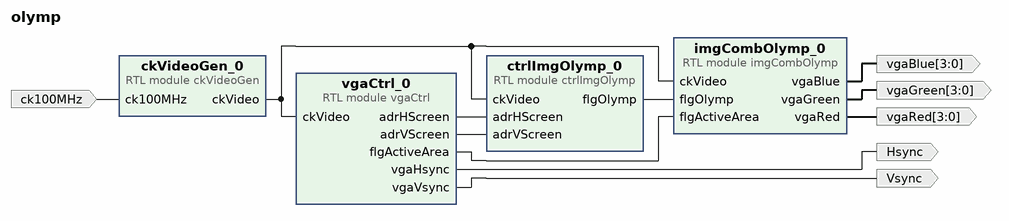
[diagram p0: block diagram of the top level]
# Vivado block design olymp, xc7a35tcpg236-1, Vivado 2019.2.1
create_bd_design olymp

create_bd_port -dir I ck100MHz
create_bd_port -dir O Hsync
create_bd_port -dir O Vsync
create_bd_port -dir O -from 3 -to 0 vgaRed
create_bd_port -dir O -from 3 -to 0 vgaGreen
create_bd_port -dir O -from 3 -to 0 vgaBlue

create_bd_cell -type module -reference imgCombOlymp imgCombOlymp_0
create_bd_cell -type module -reference ckVideoGen ckVideoGen_0
create_bd_cell -type module -reference vgaCtrl vgaCtrl_0
create_bd_cell -type module -reference ctrlImgOlymp ctrlImgOlymp_0

# ---- connections ----

connect_bd_net [get_bd_ports ck100MHz] [get_bd_pins ckVideoGen_0/ck100MHz]
connect_bd_net [get_bd_pins ckVideoGen_0/ckVideo] \
  [get_bd_pins imgCombOlymp_0/ckVideo] [get_bd_pins vgaCtrl_0/ckVideo] [get_bd_pins ctrlImgOlymp_0/ckVideo]
connect_bd_net [get_bd_pins vgaCtrl_0/adrHScreen] [get_bd_pins ctrlImgOlymp_0/adrHScreen]
connect_bd_net [get_bd_pins vgaCtrl_0/adrVScreen] [get_bd_pins ctrlImgOlymp_0/adrVScreen]
connect_bd_net [get_bd_pins ctrlImgOlymp_0/flgOlymp] [get_bd_pins imgCombOlymp_0/flgOlymp]
connect_bd_net [get_bd_pins vgaCtrl_0/flgActiveArea] [get_bd_pins imgCombOlymp_0/flgActiveArea]
connect_bd_net [get_bd_pins vgaCtrl_0/vgaHsync] [get_bd_ports Hsync]
connect_bd_net [get_bd_pins vgaCtrl_0/vgaVsync] [get_bd_ports Vsync]
connect_bd_net [get_bd_pins imgCombOlymp_0/vgaRed] [get_bd_ports vgaRed]
connect_bd_net [get_bd_pins imgCombOlymp_0/vgaGreen] [get_bd_ports vgaGreen]
connect_bd_net [get_bd_pins imgCombOlymp_0/vgaBlue] [get_bd_ports vgaBlue]

validate_bd_design
save_bd_design
